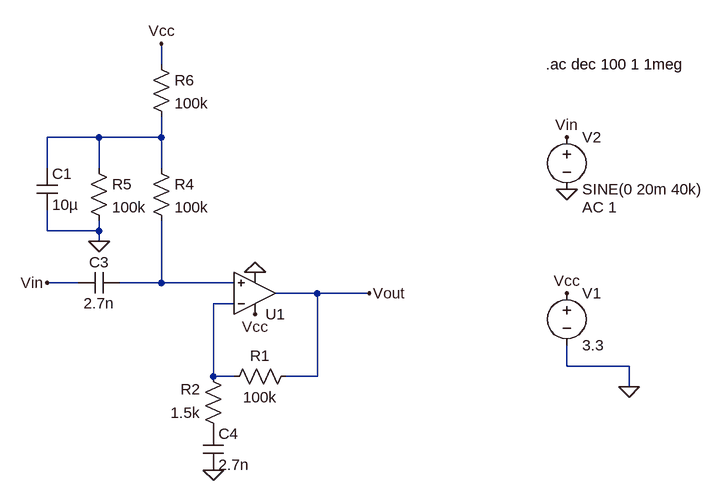
[diagram p0: schematic receiver_circuit_ltspice.asc]
receiver_circuit_ltspice.asc, the LTspice schematic file:
Version 4
SHEET 1 880 680
WIRE -304 -208 -304 -240
WIRE -400 -96 -480 -96
WIRE -304 -96 -304 -128
WIRE -304 -96 -400 -96
WIRE -480 -48 -480 -96
WIRE -400 -48 -400 -96
WIRE -304 -48 -304 -96
WIRE -480 48 -480 16
WIRE -400 48 -400 32
WIRE -400 48 -480 48
WIRE -400 64 -400 48
WIRE -432 128 -480 128
WIRE -304 128 -304 32
WIRE -304 128 -368 128
WIRE -192 128 -304 128
WIRE -64 144 -128 144
WIRE 16 144 -64 144
WIRE -192 160 -224 160
WIRE 320 256 320 224
WIRE 416 256 320 256
WIRE -224 272 -224 160
WIRE -192 272 -224 272
WIRE -64 272 -64 144
WIRE -64 272 -112 272
WIRE 416 288 416 256
FLAG -480 128 Vin
FLAG 16 144 Vout
FLAG 320 -96 Vin
FLAG 320 -16 0
FLAG 416 288 0
FLAG 320 144 Vcc
FLAG -160 176 Vcc
FLAG -224 416 0
FLAG -304 -240 Vcc
FLAG -400 64 0
FLAG -160 112 0
SYMBOL voltage 320 128 R0
WINDOW 123 0 0 Left 0
WINDOW 39 0 0 Left 0
SYMATTR InstName V1
SYMATTR Value 3.3
SYMBOL voltage 320 -112 R0
WINDOW 123 24 124 Left 2
WINDOW 39 0 0 Left 0
SYMATTR Value2 AC 1
SYMATTR InstName V2
SYMATTR Value SINE(0 20m 40k)
SYMBOL res -96 256 R90
WINDOW 0 0 56 VBottom 2
WINDOW 3 32 56 VTop 2
SYMATTR InstName R1
SYMATTR Value 100k
SYMBOL res -208 368 R180
WINDOW 0 36 76 Left 2
WINDOW 3 36 40 Left 2
SYMATTR InstName R2
SYMATTR Value 1.5k
SYMBOL cap -240 352 R0
SYMATTR InstName C4
SYMATTR Value 2.7n
SYMBOL cap -368 112 R90
WINDOW 0 0 32 VBottom 2
WINDOW 3 32 32 VTop 2
SYMATTR InstName C3
SYMATTR Value 2.7n
SYMBOL res -320 -64 R0
SYMATTR InstName R4
SYMATTR Value 100k
SYMBOL cap -496 -48 R0
SYMATTR InstName C1
SYMATTR Value 10µ
SYMBOL res -416 -64 R0
SYMATTR InstName R5
SYMATTR Value 100k
SYMBOL res -320 -224 R0
SYMATTR InstName R6
SYMATTR Value 100k
SYMBOL OpAmps\\UniversalOpAmp -160 144 M180
SYMATTR InstName U1
SYMATTR Value2 Avol=1Meg GBW=2.8Meg Vos=0
TEXT 288 -208 Left 2 !.ac dec 100 1 1meg

The netlist it stands for:
* receiver_circuit_ltspice.asc
V1 Vcc 0 3.3
V2 Vin 0 SINE(0 20m 40k) AC 1
R1 Vout N003 100k
R2 P001 N003 1.5k
C4 P001 0 2.7n
C3 N002 Vin 2.7n
R4 N001 N002 100k
C1 N001 0 10µ
R5 N001 0 100k
R6 Vcc N001 100k
XU1 N002 N003 Vcc 0 Vout level1 Avol=1Meg GBW=2.8Meg Vos=0 En=0 Enk=0 In=0 Ink=0 Rin=500Meg  ; pins In+ In- V+ V- OUT
.ac dec 100 1 1meg
.lib UniversalOpAmp1.lib
.backanno
.end